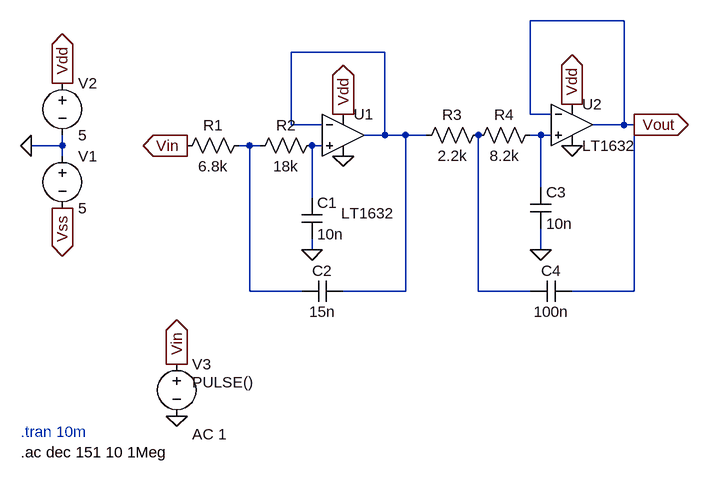
[diagram p0: schematic filterlab.asc]
filterlab.asc, the LTspice schematic file:
Version 4.1
SHEET 1 880 680
WIRE 592 -32 448 -32
WIRE 224 16 80 16
WIRE 448 112 448 -32
WIRE 480 112 448 112
WIRE 80 128 80 16
WIRE 128 128 80 128
WIRE 592 128 592 -32
WIRE 592 128 544 128
WIRE 608 128 592 128
WIRE 224 144 224 16
WIRE 224 144 192 144
WIRE 256 144 224 144
WIRE 288 144 256 144
WIRE 464 144 448 144
WIRE 480 144 464 144
WIRE -272 160 -272 144
WIRE -272 160 -320 160
WIRE 16 160 0 160
WIRE 32 160 16 160
WIRE 128 160 112 160
WIRE -272 176 -272 160
WIRE 464 224 464 144
WIRE 112 240 112 160
WIRE 112 320 112 304
WIRE 464 320 464 288
WIRE 16 384 16 160
WIRE 96 384 16 384
WIRE 256 384 256 144
WIRE 256 384 160 384
WIRE 368 384 368 144
WIRE 448 384 368 384
WIRE 608 384 608 128
WIRE 608 384 512 384
FLAG -320 160 0
FLAG -272 256 Vss
IOPIN -272 256 Out
FLAG -272 64 Vdd
IOPIN -272 64 Out
FLAG 160 112 Vdd
IOPIN 160 112 Out
FLAG 160 176 0
FLAG 512 96 Vdd
IOPIN 512 96 Out
FLAG 512 160 0
FLAG 112 320 0
FLAG -80 160 Vin
IOPIN -80 160 Out
FLAG 464 320 0
FLAG -96 496 Vin
IOPIN -96 496 Out
FLAG -96 576 0
FLAG 608 128 Vout
IOPIN 608 128 Out
SYMBOL OpAmps\\LT1632 160 80 R0
WINDOW 3 -3 184 Left 2
SYMATTR InstName U1
SYMBOL OpAmps\\LT1632 512 64 R0
SYMATTR InstName U2
SYMBOL voltage -272 160 R0
WINDOW 123 0 0 Left 0
WINDOW 39 0 0 Left 0
SYMATTR InstName V1
SYMATTR Value 5
SYMBOL voltage -272 48 R0
WINDOW 123 0 0 Left 0
WINDOW 39 0 0 Left 0
SYMATTR InstName V2
SYMATTR Value 5
SYMBOL res 16 144 R90
WINDOW 0 0 56 VBottom 2
WINDOW 3 32 56 VTop 2
SYMATTR InstName R1
SYMATTR Value 6.8k
SYMBOL res 128 144 R90
WINDOW 0 0 56 VBottom 2
WINDOW 3 32 56 VTop 2
SYMATTR InstName R2
SYMATTR Value 18k
SYMBOL cap 96 240 R0
SYMATTR InstName C1
SYMATTR Value 10n
SYMBOL cap 160 368 R90
WINDOW 0 0 32 VBottom 2
WINDOW 3 32 32 VTop 2
SYMATTR InstName C2
SYMATTR Value 15n
SYMBOL res 384 128 R90
WINDOW 0 0 56 VBottom 2
WINDOW 3 32 56 VTop 2
SYMATTR InstName R3
SYMATTR Value 2.2k
SYMBOL res 464 128 R90
WINDOW 0 0 56 VBottom 2
WINDOW 3 32 56 VTop 2
SYMATTR InstName R4
SYMATTR Value 8.2k
SYMBOL cap 448 224 R0
SYMATTR InstName C3
SYMATTR Value 10n
SYMBOL cap 512 368 R90
WINDOW 0 0 32 VBottom 2
WINDOW 3 32 32 VTop 2
SYMATTR InstName C4
SYMATTR Value 100n
SYMBOL voltage -96 480 R0
WINDOW 123 24 124 Left 2
WINDOW 39 0 0 Left 0
WINDOW 3 24 44 Left 2
SYMATTR Value2 AC 1
SYMATTR InstName V3
SYMATTR Value PULSE()
TEXT -336 600 Left 2 ;.tran 10m
TEXT -336 632 Left 2 !.ac dec 151 10 1Meg

The netlist it stands for:
* filterlab.asc
X§U1 N004 N001 Vdd 0 N001 LT1632  ; pins In+ In- V+ V- OUT
X§U2 N002 Vout Vdd 0 Vout LT1632  ; pins In+ In- V+ V- OUT
V1 0 Vss 5
V2 Vdd 0 5
R1 N003 Vin 6.8k
R2 N004 N003 18k
C1 N004 0 10n
C2 N001 N003 15n
R3 N005 N001 2.2k
R4 N002 N005 8.2k
C3 N002 0 10n
C4 Vout N005 100n
V3 Vin 0 PULSE() AC 1
* .tran 10m
.ac dec 151 10 1Meg
.lib LTC.lib
.backanno
.end